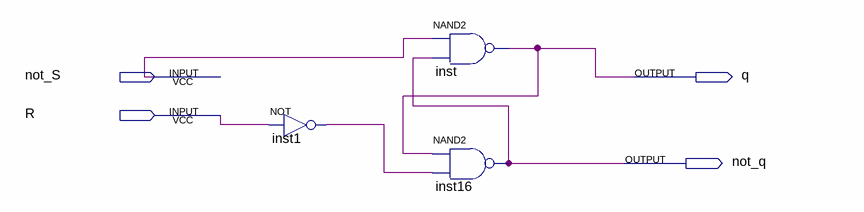
[diagram p0: schematic sheet]
// Quartus schematic ff1.bdf as structural Verilog: 3 symbols, 4 pins
module ff1 (
  input  not_S,
  input  R,
  output q,
  output not_q
);

  wire inst1_out;

  not inst1 (inst1_out, R);
  nand inst (q, not_S, not_q);
  nand inst16 (not_q, q, inst1_out);
endmodule
